# Altium schematic sheet Breakout_board_v3.SchDoc: Linuxstamp II Breakout Board
size A4; DrawnBy: Konstantin Borschiov; SheetTotal: 1
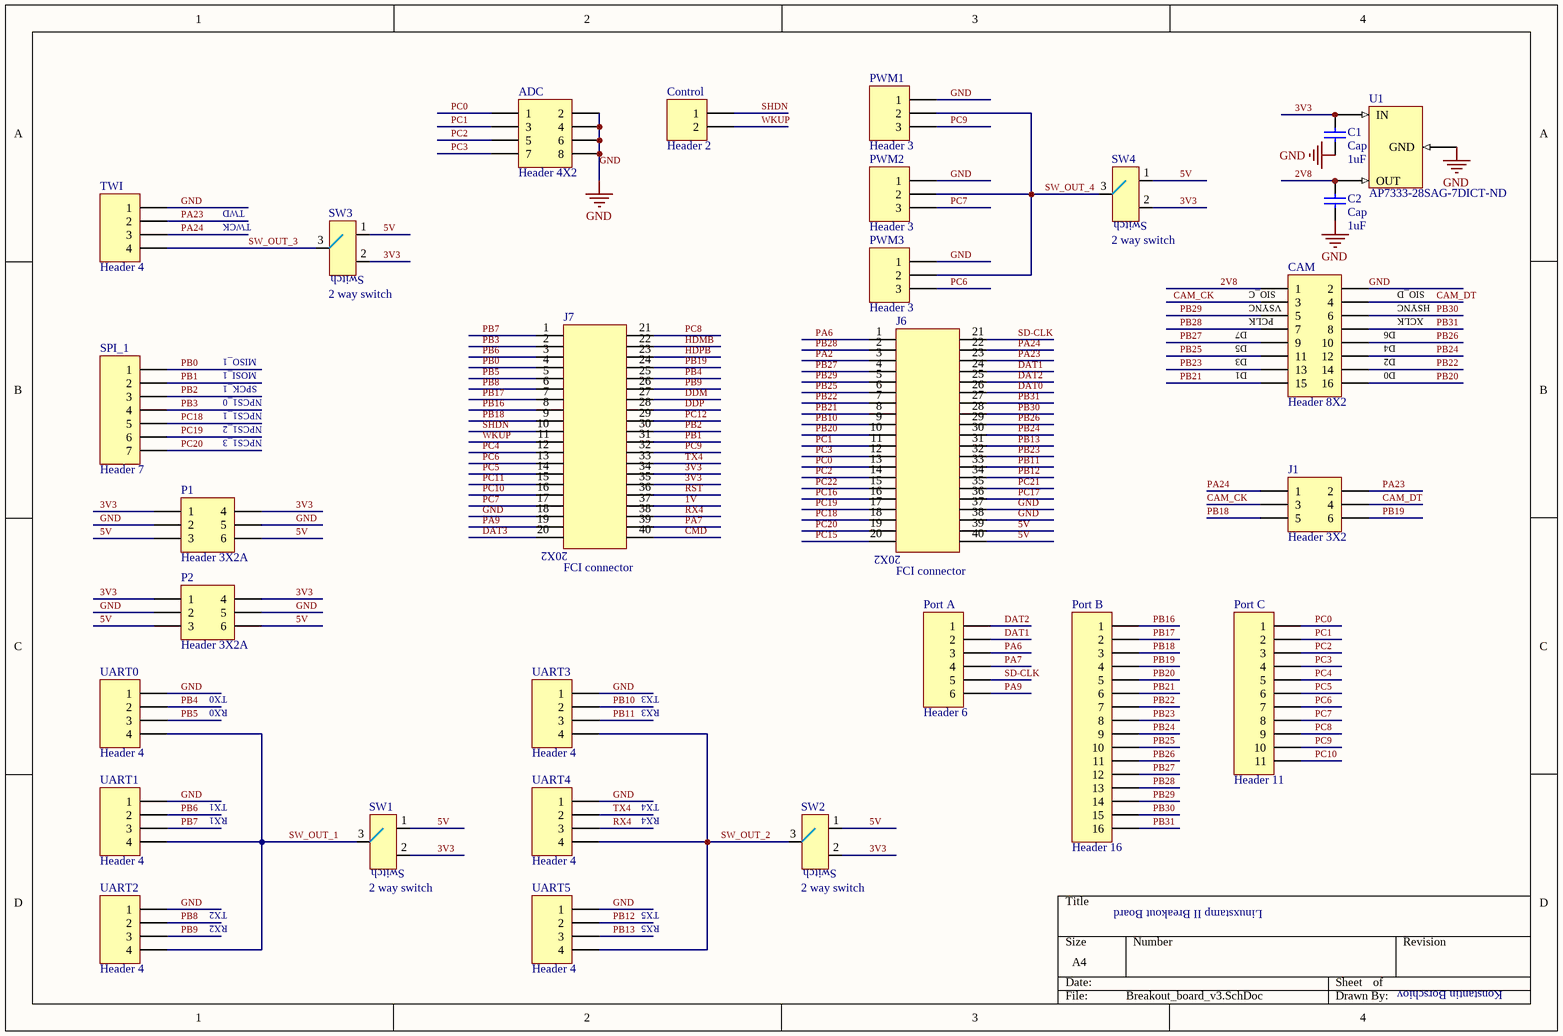
[diagram p0: Breakout_board_v3.SchDoc]

## Parts
ADC  Header 4X2  [HDR2X4]
C1  Cap  value 1uF  [CAPR2.54-5.1x3.2]
C2  Cap  value 1uF  [CAPR2.54-5.1x3.2]
CAM  Header 8X2  [HDR2X8]
Control  Header 2  [HDR1X2]
J1  Header 3X2  [HDR2X3]
J6  FCI connector  [FCI_61082_041402LF]
J7  FCI connector  [FCI_61082_041402LF]
P1  Header 3X2A  [HDR2X3_CEN]
P2  Header 3X2A  [HDR2X3_CEN]
Port_A  Header 6  [HDR1X6]
Port_B  Header 16  [HDR1X16]
Port_C  Header 11  [HDR1X11]
PWM1  Header 3  [HDR1X3]
PWM2  Header 3  [HDR1X3]
PWM3  Header 3  [HDR1X3]
SPI_1  Header 7  [HDR1X7]
SW1  2 way switch  [Tyco_SLS121PC04]
SW2  2 way switch  [Tyco_SLS121PC04]
SW3  2 way switch  [Tyco_SLS121PC04]
SW4  2 way switch  [Tyco_SLS121PC04]
TWI  Header 4  [HDR1X4]
U1  Supplier Part Number 1: AP7333-28SAG-7DICT-ND  [PCBComponent_1]  (hidden comment: Voltage Regulator - Linear, 2.8V output)
UART0  Header 4  [HDR1X4]
UART1  Header 4  [HDR1X4]
UART2  Header 4  [HDR1X4]
UART3  Header 4  [HDR1X4]
UART4  Header 4  [HDR1X4]
UART5  Header 4  [HDR1X4]

## Nets
GND: ADC.2 ADC.4 ADC.6 ADC.8 C1.1 C2.1 CAM.2 J6.37 J6.38 J7.18 P1.2 P1.5 P2.2 P2.5 PWM1.1 PWM2.1 PWM3.1 TWI.1 U1.2(GND) UART0.1 UART1.1 UART2.1 UART3.1 UART4.1 UART5.1
1V: J7.37
2V8: C2.2 CAM.1 U1.1(OUT)
3V3: C1.2 J7.34 J7.35 P1.1 P1.4 P2.1 P2.4 SW1.2 SW2.2 SW3.2 SW4.2 U1.0(IN)
5V: J6.39 J6.40 P1.3 P1.6 P2.3 P2.6 SW1.1 SW2.1 SW3.1 SW4.1
CAM_CK: CAM.3 J1.3
CAM_DT: CAM.4 J1.4
CMD: J7.40
DAT0: J6.26
DAT1: J6.24 Port_A.2
DAT2: J6.25 Port_A.1
DAT3: J7.20
DDM: J7.27
DDP: J7.28
HDMB: J7.22
HDPB: J7.23
PA2: J6.3
PA6: J6.1 Port_A.3
PA7: J7.39 Port_A.4
PA9: J7.19 Port_A.6
PA23: J1.2 J6.23 TWI.2
PA24: J1.1 J6.22 TWI.3
PB0: J7.4 SPI_1.1
PB1: J7.31 SPI_1.2
PB2: J7.30 SPI_1.3
PB3: J7.2 SPI_1.4
PB4: J7.25 UART0.2
PB5: J7.5 UART0.3
PB6: J7.3 UART1.2
PB7: J7.1 UART1.3
PB8: J7.6 UART2.2
PB9: J7.26 UART2.3
PB10: J6.9 UART3.2
PB11: J6.33 UART3.3
PB12: J6.34 UART5.2
PB13: J6.31 UART5.3
PB16: J7.8 Port_B.1
PB17: J7.7 Port_B.2
PB18: J1.5 J7.9 Port_B.3
PB19: J1.6 J7.24 Port_B.4
PB20: CAM.16 J6.10 Port_B.5
PB21: CAM.15 J6.8 Port_B.6
PB22: CAM.14 J6.7 Port_B.7
PB23: CAM.13 J6.32 Port_B.8
PB24: CAM.12 J6.30 Port_B.9
PB25: CAM.11 J6.6 Port_B.10
PB26: CAM.10 J6.29 Port_B.11
PB27: CAM.9 J6.4 Port_B.12
PB28: CAM.7 J6.2 Port_B.13
PB29: CAM.5 J6.5 Port_B.14
PB30: CAM.6 J6.28 Port_B.15
PB31: CAM.8 J6.27 Port_B.16
PC0: ADC.1 J6.13 Port_C.1
PC1: ADC.3 J6.11 Port_C.2
PC2: ADC.5 J6.14 Port_C.3
PC3: ADC.7 J6.12 Port_C.4
PC4: J7.12 Port_C.5
PC5: J7.14 Port_C.6
PC6: J7.13 Port_C.7 PWM3.3
PC7: J7.17 Port_C.8 PWM2.3
PC8: J7.21 Port_C.9
PC9: J7.32 Port_C.10 PWM1.3
PC10: J7.16 Port_C.11
PC11: J7.15
PC12: J7.29
PC15: J6.20
PC16: J6.16
PC17: J6.36
PC18: J6.18 SPI_1.5
PC19: J6.17 SPI_1.6
PC20: J6.19 SPI_1.7
PC21: J6.35
PC22: J6.15
RST: J7.36
RX4: J7.38 UART4.3
SD-CLK: J6.21 Port_A.5
SHDN: Control.1 J7.10
SW_OUT_1: SW1.3 UART0.4 UART1.4 UART2.4
SW_OUT_2: SW2.3 UART3.4 UART4.4 UART5.4
SW_OUT_3: SW3.3 TWI.4
SW_OUT_4: PWM1.2 PWM2.2 PWM3.2 SW4.3
TX4: J7.33 UART4.2
WKUP: Control.2 J7.11

## Notes on the sheet
- TWD
- TWCK
- (near CAM) SIO_C
- (near CAM) VSYNC
- (near CAM) HSYNC
- (near CAM) SIO_D
- MISO_1
- MOSI_1
- D7
- D5
- D1
- D3
- (near CAM) PCLK
- (near CAM) D0
- (near CAM) D2
- (near CAM) D4
- (near CAM) D6
- (near CAM) XCLK
- SPCK_1
- NPCS1_0
- NPCS1_1
- NPCS1_2
- NPCS1_3
- TX0
- RX0
- TX3
- RX3
- TX1
- RX1
- TX4
- RX4
- TX2
- TX5
- RX2
- RX5
- (in symbol FCI connector) 20X2
- (in symbol Tyco_SLS121PC04) Switch

## Library data of the parts
ADC = Header 4X2: Header, 4-Pin, Dual row; LatestRevisionDate: 17-Jul-2002; LatestRevisionNote: Re-released for DXP Platform.; Publisher: Altium Limited
C1 C2 = Cap: Capacitor; Published: 8-Jun-2000; LatestRevisionDate: 17-Jul-2002; LatestRevisionNote: Re-released for DXP Platform.; PackageReference: RAD-0.3; Publisher: Altium Limited
CAM = Header 8X2: Header, 8-Pin, Dual row; LatestRevisionDate: 17-Jul-2002; LatestRevisionNote: Re-released for DXP Platform.; Publisher: Altium Limited
Control = Header 2: Header, 2-Pin; LatestRevisionDate: 17-Jul-2002; LatestRevisionNote: Re-released for DXP Platform.; Publisher: Altium Limited
J1 = Header 3X2: Header, 3-Pin, Dual row; LatestRevisionDate: 17-Jul-2002; LatestRevisionNote: Re-released for DXP Platform.; Publisher: Altium Limited
J6 J7 = FCI connector: 40 pin Dual in line connector
P1 P2 = Header 3X2A: Header, 3-Pin, Dual row; LatestRevisionDate: 17-Jul-2002; LatestRevisionNote: Re-released for DXP Platform.; Publisher: Altium Limited
Port_A = Header 6: Header, 6-Pin; LatestRevisionDate: 17-Jul-2002; LatestRevisionNote: Re-released for DXP Platform.; Publisher: Altium Limited
Port_B = Header 16: Header, 16-Pin; LatestRevisionDate: 17-Jul-2002; LatestRevisionNote: Re-released for DXP Platform.; Publisher: Altium Limited
Port_C = Header 11: Header, 11-Pin; LatestRevisionDate: 17-Jul-2002; LatestRevisionNote: Re-released for DXP Platform.; Publisher: Altium Limited
PWM1-PWM3 = Header 3: Header, 3-Pin; LatestRevisionDate: 17-Jul-2002; LatestRevisionNote: Re-released for DXP Platform.; Publisher: Altium Limited
SPI_1 = Header 7: Header, 7-Pin; LatestRevisionDate: 17-Jul-2002; LatestRevisionNote: Re-released for DXP Platform.; Publisher: Altium Limited
SW1-SW4 = Tyco_SLS121PC04
TWI UART0-UART5 = Header 4: Header, 4-Pin; LatestRevisionDate: 17-Jul-2002; LatestRevisionNote: Re-released for DXP Platform.; Publisher: Altium Limited
U1 = Voltage Regulator - Linear, 2.8V output: Supplier 1: Digi-Key; ComponentLink1Description: Manufacturer Link; ComponentLink1URL: http://www.diodes.com/; ComponentLink2Description: Datasheet; ComponentLink2URL: http://www.diodes.com/; PackageReference: SOT23; Value: 2.8V